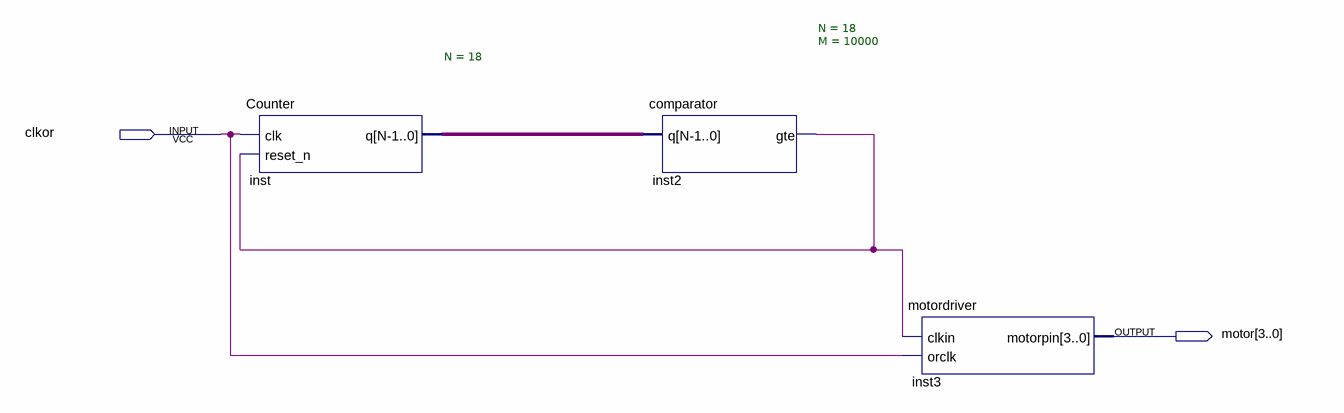
[diagram p0: schematic sheet]
// Quartus schematic motortest.bdf as structural Verilog: 3 symbols, 2 pins
module motortest (
  input  clkor,
  output [3:0] motor
);

  wire inst2_gte;
  wire [17:0] inst_q;

  Counter #(.N(18)) inst (.clk(clkor), .reset_n(inst2_gte), .q(inst_q));
  comparator #(.N(18), .M(10000)) inst2 (.q(inst_q), .gte(inst2_gte));
  motordriver inst3 (.clkin(inst2_gte), .orclk(clkor), .motorpin(motor));
endmodule
